# Altium schematic sheet M8-LDO_3.3V.SchDoc
size A4; ApprovedBy: -; CheckedBy: h.t.t.monfared; Author: h.t.t.monfared; Engineer: h.t.t.monfared; Revision: 1.00; SheetNumber: 8; SheetTotal: 10; Project Code:: UFM Sensor Controller; Document Title:: LDO 3.3V
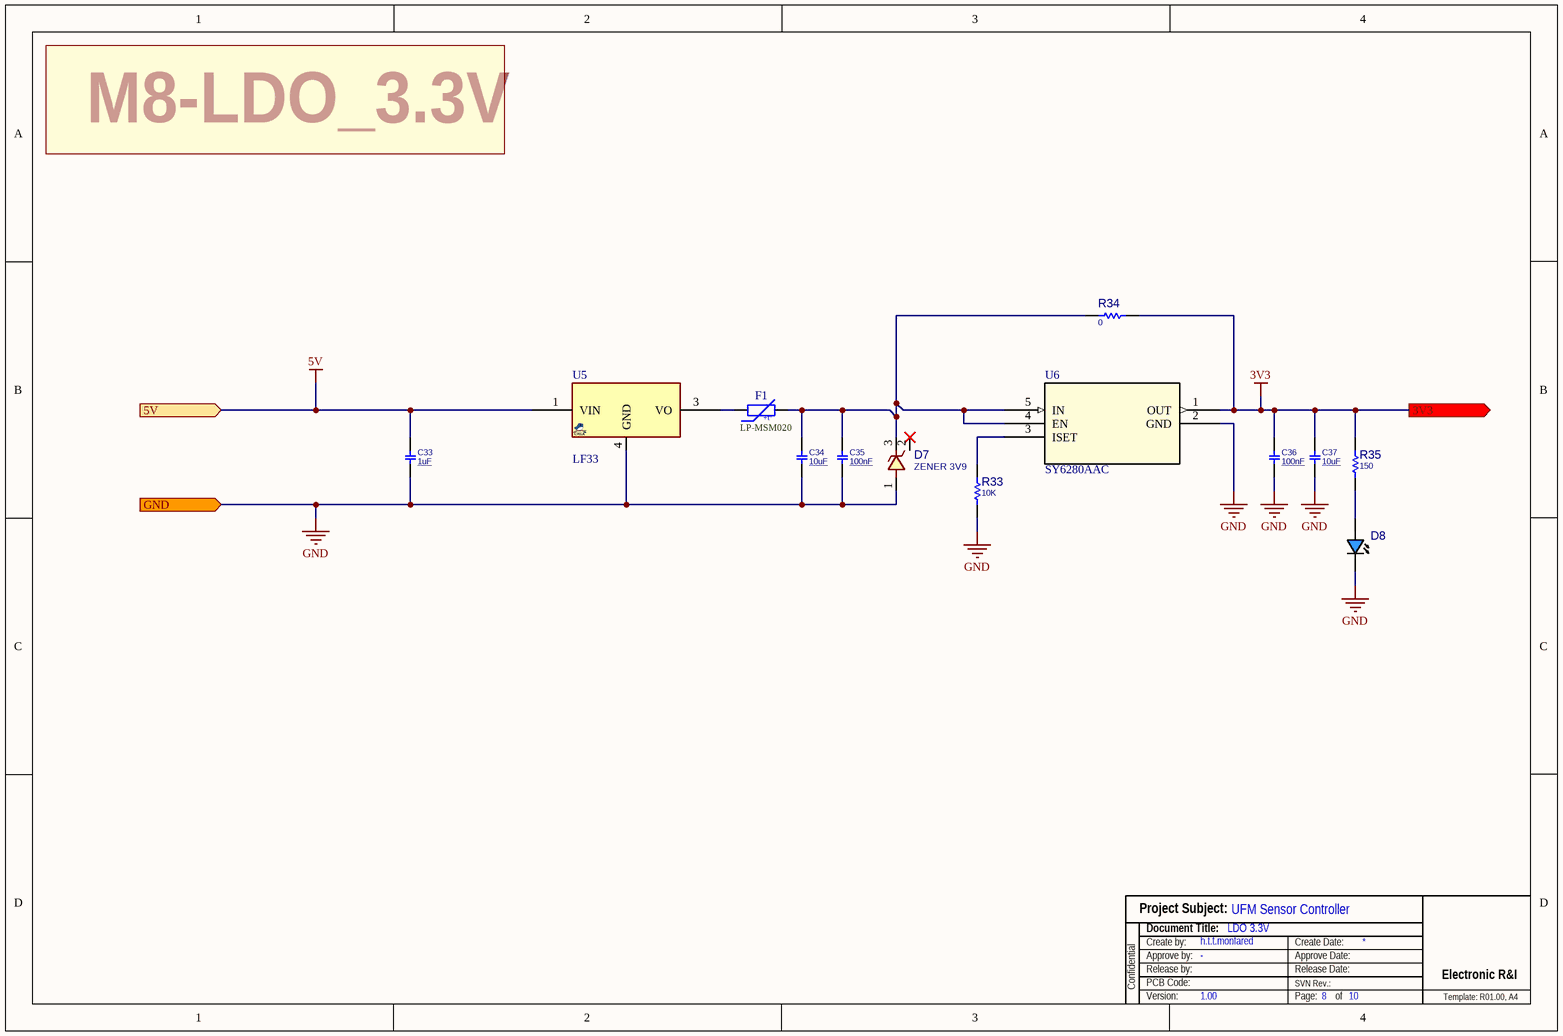
[diagram p0: M8-LDO_3.3V.SchDoc]

## Parts
C33  1uF  [C1206]
C34  10uF  [C1206]
C35  100nF  [C1206]
C36  100nF  [C1206]
C37  10uF  [C1206]
D7  ZENER 3V9  [SOT23_3]
D8  LED1206BLU  [LED1206BLU]  (value not drawn)
F1  LP-MSM020  [F-1812(4532)]
R33  10K  [R1206]
R34  0  [R1206]
R35  150  [R1206]
U5  LF33  [DPAK_3]
U6  SY6280AAC  [SOT23_5]

## Ports
3V3 (out), 5V (in), GND (in)

## Nets
3V3: C36.2 C37.2 R34.2 R35.2 U6.1(OUT) ; port 3V3
5V: C33.2 U5.1(VIN) ; port 5V
GND: C33.1 C34.1 C35.1 C36.1 C37.1 D7.1 D8.2(CATHODE) R33.1 U5.4(GND) U6.2(GND) ; port GND
NetC34_2: C34.2 C35.2 D7.3 F1.2 R34.1 U6.4(EN) U6.5(IN)
NetD8_1: D8.1(ANODE) R35.1
NetF1_1: F1.1 U5.3(VO)
NetR33_2: R33.2 U6.3(ISET)

Not connected (* = marked no-connect by the designer): D7 2*

## Notes on the sheet
- M8-LDO_3.3V
- Project Subject:
- Confidential
- Release by:
- Document Title:
- Create by:
- PCB Code:
- Approve by:
- SVN Rev.:
- Create Date:
- Release Date:
- Approve Date:
- Electronic R&I
- Version:
- Page:
- of
- Template: R01.00, A4
- (in symbol ME05901801) +t°

## Library data of the parts
C33-C37 = CAP_SMD_MLCC: CAP, MLCC, 1nF, 50V, C0G, 10%, 0402; MANF_P#: MANF_PART#; MANF: Murata; PARAM: C0G, 10%; PRICE: 100= 1$; DESC: CAP, MLCC, 1nF, 50V, C0G, 10%, 0402; PARAM2: 50V; ASSEMBLY: ASSEMBLY
  C33: VALUE: 1uF
  C34 C37: VALUE: 10uF
  C35 C36: VALUE: 100nF
D7 = DIODE_SMD_ZENER_BZX84-C6V2: DIODE, ZENER, 0.25W, 3.9V; MANF: NXP; DESC: DESCRIPTION; PARAM2: 3.9V, 0.9VF; PARAM: 0.25W, 10mA IF; MANF_P#: BZX84-C3V9; ASSEMBLY: ASSEMBLY; PRICE: PRICE; VALUE: ZENER 3V9
D8 = LED_SMD_1206_BLU: LED, SMD, 1206, BLUE; DESC: DESCRIPTION; MANF_P#: MANF_PART#; PARAM2: 2.2V; MANF: MANF; ASSEMBLY: ASSEMBLY; PRICE: 36t@Javan; VALUE: LED1206BLU
F1 = ME05901801: Thermistor,S,PTC,0.2A,1W,1812; Manufacturer 1: CYG; Manufacturer Code1: 0000102083; Manufacturer Name1: Wayon Electronics Co.,Ltd; Unit Price (USD): Coming Soon; Alternative: Please Add; Description Farsi: ترميستور,S,PTC,0.2A,1W,1812; LeadTime: 110; Current-Trip: 0.4A; Designator: RT; Packing: TAPE AND REEL; Temperature-Max Operation: 85°C; Temperature-Min Operation: -40°C; Unit-measurement: PC; Value: 0.6(Ohm); Voltage-Rated: 30V; Material: ME05901801; Function in Circuit: Please Add; Material Class: Thermistor; ComponentLink1Description: DSH2029237RE: Datasheet-CYG; ComponentLink1URL: \\192.168.5.63\eRI_ComponentDatabase\Datasheets\SAP\DSH_2029237_00_1.PDF; Current-Hold: 0.2A; General MPN: LP-MSM020; Lead Free: YES; Manufacturer PN1: LP-MSM020; MPN1: LP-MSM020; Package/Case: 1812; Power: 1W; Termination Style (SMD/THT): SMD; Type: PTC
R33-R35 = RES_SMD: RESISTOR, SMD; PARAM: -W; DESC: DESCRIPTION; DIST#: MOUSER; PARAM2: 1%; MANF_P#: -; MANF: -; ASSEMBLY: ASSEMBLY; PRICE: 100= 0.5$
  R33: VALUE: 10K
  R34: VALUE: 0
  R35: VALUE: 150
U5 = VREG_LFXX_TO252: REG, Linear, LDO0.45V, 0.5A, TO-252; MANF: ST; PARAM2: 1.5/1.8/2.5/3.3/5V; MANF_P#: LF33; PARAM: LDO0.45V, 0.5A; PRICE: 1500t; VALUE: LF33
U6 = SY6280AAC: No Description Available; Mfr_Name: Silergy; Copyright: Copyright (C) 2023 Ultra Librarian. All rights reserved.; Manufacturer_Part_Number: SY6280AAC; RefDes: RefDes; Type: DEV